# EAGLE schematic EYEO_Flower3 (EAGLE 9.6.2)
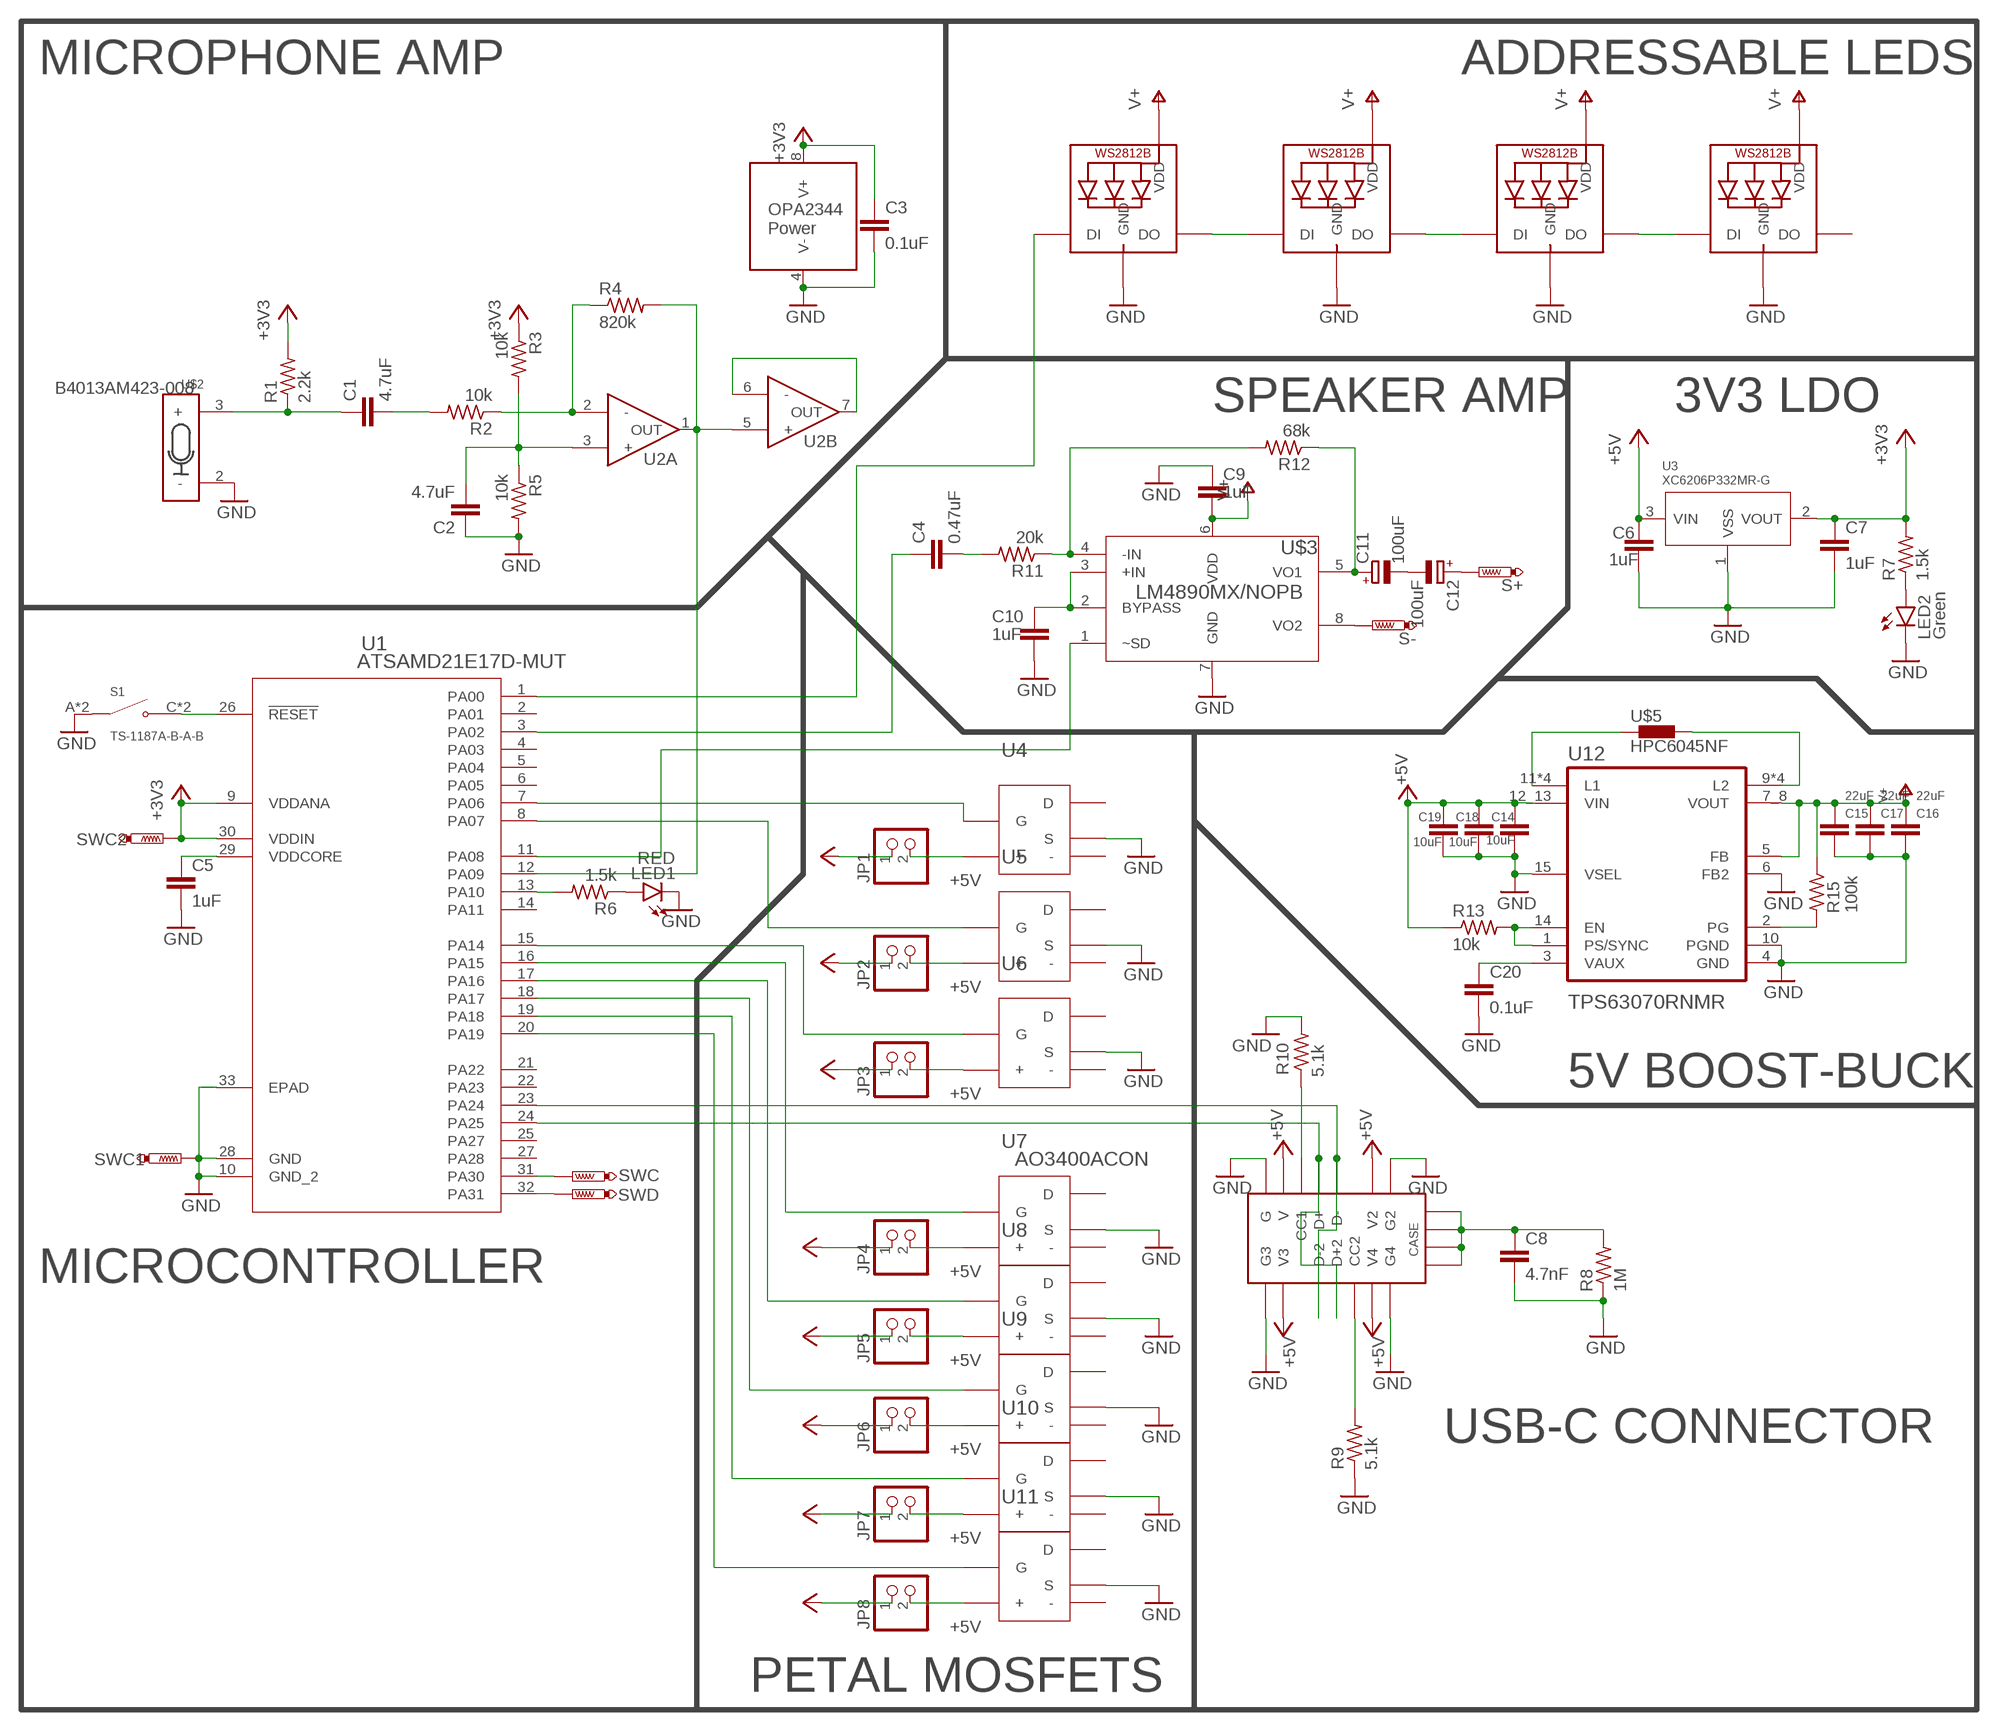
[diagram p0: schematic, sheet 1]

## Parts
C1  4.7uF  C-EUC0603  [C0603]
C2  4.7uF  C-EUC0603  [C0603]
C3  0.1uF  C-EUC0402  [C0402]
C4  0.47uF  C-EUC0603  [C0603]
C5  1uF  C-EUC0603  [C0603]
C6  1uF  C-EUC0603  [C0603]
C7  1uF  C-EUC0603  [C0603]
C8  4.7nF  C-EUC0402  [C0402]
C9  1uF  C-EUC0603  [C0603]
C10  1uF  C-EUC0603  [C0603]
C11  100uF  CPOL-EU153CLV-0505  [153CLV-0505]
C12  100uF  CPOL-EU153CLV-0505  [153CLV-0505]
C14  10uF  C-EUC0603  [C0603]
C15  22uF  C-EUC0603  [C0603]
C16  22uF  C-EUC0603  [C0603]
C17  22uF  C-EUC0603  [C0603]
C18  10uF  C-EUC0603  [C0603]
C19  10uF  C-EUC0603  [C0603]
C20  0.1uF  C-EUC0402  [C0402]
JP1  PINHD-1X2  [1X02]
JP2  PINHD-1X2  [1X02]
JP3  PINHD-1X2  [1X02]
JP4  PINHD-1X2  [1X02]
JP5  PINHD-1X2  [1X02]
JP6  PINHD-1X2  [1X02]
JP7  PINHD-1X2  [1X02]
JP8  PINHD-1X2  [1X02]
LED1  RED  LEDCHIPLED_0805  [CHIPLED_0805]
LED2  Green  LEDCHIPLED_0603  [CHIPLED_0603]
LED3  WS2812B5050  [WS2812B]
LED4  WS2812B5050  [WS2812B]
LED5  WS2812B5050  [WS2812B]
LED6  WS2812B5050  [WS2812B]
R1  2.2k  R-US_R0402  [R0402]
R2  10k  R-US_R0402  [R0402]
R3  10k  R-US_R0402  [R0402]
R4  820k  R-US_R0402  [R0402]
R5  10k  R-US_R0402  [R0402]
R6  1.5k  R-US_R0402  [R0402]
R7  1.5k  R-US_R0402  [R0402]
R8  1M  R-US_R0402  [R0402]
R9  5.1k  R-US_R0402  [R0402]
R10  5.1k  R-US_R0402  [R0402]
R11  20k  R-US_R0402  [R0402]
R12  68k  R-US_R0402  [R0402]
R13  10k  R-US_R0402  [R0402]
R15  100k  R-US_R0402  [R0402]
S1  TS-1187A-B-A-B  [SW_TS-1187A-B-A-B]
S+  PTR11MM  [1MM]
S-  PTR11MM  [1MM]
SWC  PTR1PAD1-13  [P1-13]
SWC1  PTR1PAD1-13  [P1-13]
SWC2  PTR1PAD1-13  [P1-13]
SWD  PTR1PAD1-13  [P1-13]
U1  ATSAMD21E17D-MUT  [QFN32_5X5MC_MCH]
U2  OPA2344UA  [D8]
U3  XC6206P332MR-G  PMIC-LDO-XC6206P332MR-G(SOT23)  [SOT-23]
U4  AO3400ACON  [SOT23-BCE-CON]
U5  AO3400ACON  [SOT23-BCE-CON]
U6  AO3400ACON  [SOT23-BCE-CON]
U7  AO3400ACON  [SOT23-BCE-CON]
U8  AO3400ACON  [SOT23-BCE-CON]
U9  AO3400ACON  [SOT23-BCE-CON]
U10  AO3400ACON  [SOT23-BCE-CON]
U11  AO3400ACON  [SOT23-BCE-CON]
U12  TPS63070RNMR  [VREG_TPS63070RNMR]
U$1  USB-C  [918-418K2022Y40000]
U$2  B4013AM423  [B4013AM423]
U$3  LM4890MX/NOPB  [M08A]
U$5  HPC6045NF  [HPC6045NF]

## Nets
+3V3: C3.1 C7.1 R1.2 R3.1 R7.2 SWC2.TP U1.9(VDDANA) U1.30(VDDIN) U2.8(C:V+) U3.2(VOUT)
+5V: C6.1 C14.1 C18.1 C19.1 JP1.1 JP2.1 JP3.1 JP4.1 JP5.1 JP6.1 JP7.1 JP8.1 R13.1 U3.3(VIN) U12.12_13(VIN) U$1.V U$1.V2 U$1.V3 U$1.V4
GND: C2.1 C3.2 C5.2 C6.2 C7.2 C8.2 C9.1 C10.2 C14.2 C15.2 C16.2 C17.2 C18.2 C19.2 C20.2 LED1.C LED2.C LED3.3-GND(GND) LED4.3-GND(GND) LED5.3-GND(GND) LED6.3-GND(GND) R5.2 R8.1 R9.1 R10.2 S1.A(COM) S1.B(COM) SWC1.TP U1.10(GND_2) U1.28(GND) U1.33(EPAD) U2.4(C:V-) U3.1(VSS) U4.S U5.S U6.S U7.S U8.S U9.S U10.S U11.S U12.4(GND) U12.6(FB2) U12.10(PGND) U12.15(VSEL) U$1.G U$1.G2 U$1.G3 U$1.G4 U$2.2(-) U$3.7(GND)
N$1: LED1.A R6.1
N$2: S1.C(NO) S1.D(NO) U1.26(!RESET)
N$3: LED2.A R7.1
N$4: C5.1 U1.29(VDDCORE)
N$5: C8.1 R8.2 U$1.OG1 U$1.OG2 U$1.OG3 U$1.OG4
N$6: R6.2 U1.13(PA10)
N$7: U1.23(PA24) U$1.D- U$1.D-2
N$8: U1.24(PA25) U$1.D+ U$1.D+2
N$11: R4.2 U1.12(PA09) U2.1(A:OUT) U2.5(B:+)
N$12: R2.1 R4.1 U2.2(A:-)
N$13: R10.1 U$1.CC1
N$14: R9.2 U$1.CC2
N$15: C2.2 R3.2 R5.1 U2.3(A:+)
N$16: C1.2 R2.2
N$17: C1.1 R1.1 U$2.3(+)
N$18: U2.6(B:-) U2.7(B:OUT)
N$19: C4.1 U1.3(PA02)
N$20: C4.2 R11.2
N$21: R11.1 R12.2 U$3.4(-IN)
N$22: C11.- C12.-
N$23: C10.1 U$3.2(BYPASS) U$3.3(+IN)
N$24: C11.+ R12.1 U$3.5(VO1)
N$25: U1.11(PA08) U$3.1(~SD)
N$26: S-.TP U$3.8(VO2)
N$27: U1.7(PA06) U4.G
N$28: U1.8(PA07) U5.G
N$29: U1.15(PA14) U6.G
N$30: U1.16(PA15) U7.G
N$31: U1.17(PA16) U8.G
N$32: U1.18(PA17) U9.G
N$33: U1.19(PA18) U10.G
N$34: U1.20(PA19) U11.G
N$35: LED3.4-DIN(DI) U1.1(PA00)
N$36: LED3.2-DOUT(DO) LED4.4-DIN(DI)
N$37: LED4.2-DOUT(DO) LED5.4-DIN(DI)
N$38: LED5.2-DOUT(DO) LED6.4-DIN(DI)
N$39: C12.+ S+.TP
N$40: JP1.2 U4.+
N$41: JP2.2 U5.+
N$42: JP3.2 U6.+
N$43: JP4.2 U7.+
N$44: JP5.2 U8.+
N$45: JP6.2 U9.+
N$46: JP7.2 U10.+
N$47: JP8.2 U11.+
N$49: R13.2 U12.1(PS/SYNC) U12.14(EN)
N$50: U12.11(L1) U12.11_1(L1) U12.11_2(L1) U12.11_3(L1) U$5.P$1
N$51: C20.1 U12.3(VAUX)
N$52: U12.9(L2) U12.9_1(L2) U12.9_2(L2) U12.9_3(L2) U$5.P$2
N$54: R15.2 U12.2(PG)
SWC: SWC.TP U1.31(PA30)
SWD: SWD.TP U1.32(PA31)
V+: C9.2 C15.1 C16.1 C17.1 LED3.1-VDD(VDD) LED4.1-VDD(VDD) LED5.1-VDD(VDD) LED6.1-VDD(VDD) R15.1 U12.5(FB) U12.7_8(VOUT) U$3.6(VDD)
Unconnected: LED6.2-DOUT(DO) U1.2(PA01) U1.4(PA03) U1.5(PA04) U1.6(PA05) U1.14(PA11) U1.21(PA22) U1.22(PA23) U1.25(PA27) U1.27(PA28) U4.- U4.D U5.- U5.D U6.- U6.D U7.- U7.D U8.- U8.D U9.- U9.D U10.- U10.D U11.- U11.D

## Notes on the sheet
- MICROPHONE AMP | ADDRESSABLE LEDS
- SPEAKER AMP | 3V3 LDO
- 5V BOOST-BUCK
- MICROCONTROLLER
- USB-C CONNECTOR
- PETAL MOSFETS

## Library data of the parts
C1 C2 = rcl_MOD:C-EU: CAPACITOR, European symbol; LCSC_PART: C19666; SPICEPREFIX: C
C3 C20 = rcl_MOD:C-EU: CAPACITOR, European symbol; LCSC_PART: C307331; SPICEPREFIX: C
C4 = rcl_MOD:C-EU: CAPACITOR, European symbol; LCSC_PART: C1623; SPICEPREFIX: C
C5-C7 C9 C10 = rcl_MOD:C-EU: CAPACITOR, European symbol; LCSC_PART: C15849; SPICEPREFIX: C
C8 = rcl_MOD:C-EU: CAPACITOR, European symbol; LCSC_PART: C1538; SPICEPREFIX: C
C11 C12 = rcl_MOD:CPOL-EU: POLARIZED CAPACITOR, European symbol; LCSC_PART: C3347; SPICEPREFIX: C
C14 C18 C19 = rcl_MOD:C-EU: CAPACITOR, European symbol; LCSC_PART: C96446; SPICEPREFIX: C
C15-C17 = rcl_MOD:C-EU: CAPACITOR, European symbol; LCSC_PART: C59461; SPICEPREFIX: C
JP1-JP8 = pinhead:PINHD-1X2: PIN HEADER; LCSC_PART: C2889984
LED1 = led:LED: LED OSRAM: - CHIPLED LG R971, LG N971, LY N971, LG Q971, LY Q971, LO R971, LY R971 LH N974, LH R974 LS Q976, LO Q976, LY Q976 LO Q996 - Hyper CHIPLED LW Q18S LB Q993, LB Q99A, LB R99A - SideLED LS A670, LO A670, LY A670, LG A670, LP A670 LB A673, LV A673, LT A673, LW A673 LH A674 LY A675 LS A676, LA A676, LO A676, LY A676, LW A676 LS A679, LY A679, LG A679 - Hyper Micro SIDELED® LS Y876, LA Y876, LO Y876, LY Y876 LT Y87S - SmartLED LW L88C, LW L88S LB L89C, LB L89S, LG L890 LS L89K, LO L89K, LY L89K LS L896, LA L896, LO L896, LY L896 - TOPLED LS T670, LO T670, LY T670, LG T670, LP T670 LSG T670, LSP T670, LSY T670, LOP T670, LYG T670 LG T671, LOG T671, LSG T671 LB T673, LV T673, LT T673, LW T673 LH T674 LS T676, LA T676, LO T676, LY T676, LB T676, LH T676, LSB T676, LW T676 LB T67C, LV T67C, LT T67C, LS T67K, LO T67K, LY T67K, LW E67C LS E67B, LA E67B, LO E67B, LY E67B, LB E67C, LV E67C, LT E67C LW T67C LS T679, LY T679, LG T679 LS T770, LO T770, LY T770, LG T770, LP T770 LB T773, LV T773, LT T773, LW T773 LH T774 LS E675, LA E675, LY E675, LS T675 LS T776, LA T776, LO T776, LY T776, LB T776 LHGB T686 LT T68C, LB T68C - Hyper Mini TOPLED® LB M676 - Mini TOPLED Santana® LG M470 LS M47K, LO M47K, LY M47K Source: http://www.osram.convergy.de LUXEON: - LUMILED® LXK2-PW12-R00, LXK2-PW12-S00, LXK2-PW14-U00, LXK2-PW14-V00 LXK2-PM12-R00, LXK2-PM12-S00, LXK2-PM14-U00 LXK2-PE12-Q00, LXK2-PE12-R00, LXK2-PE12-S00, LXK2-PE14-T00, LXK2-PE14-U00 LXK2-PB12-K00, LXK2-PB12-L00, LXK2-PB12-M00, LXK2-PB14-N00, LXK2-PB14-P00, LXK2-PB14-Q00 LXK2-PR12-L00, LXK2-PR12-M00, LXK2-PR14-Q00, LXK2-PR14-R00 LXK2-PD12-Q00, LXK2-PD12-R00, LXK2-PD12-S00 LXK2-PH12-R00, LXK2-PH12-S00 LXK2-PL12-P00, LXK2-PL12-Q00, LXK2-PL12-R00 Source: www.luxeon.com KINGBRIGHT: KA-3528ASYC Source: www.kingbright.com; LCSC_PART: C84256
LED2 = led:LED: LED OSRAM: - CHIPLED LG R971, LG N971, LY N971, LG Q971, LY Q971, LO R971, LY R971 LH N974, LH R974 LS Q976, LO Q976, LY Q976 LO Q996 - Hyper CHIPLED LW Q18S LB Q993, LB Q99A, LB R99A - SideLED LS A670, LO A670, LY A670, LG A670, LP A670 LB A673, LV A673, LT A673, LW A673 LH A674 LY A675 LS A676, LA A676, LO A676, LY A676, LW A676 LS A679, LY A679, LG A679 - Hyper Micro SIDELED® LS Y876, LA Y876, LO Y876, LY Y876 LT Y87S - SmartLED LW L88C, LW L88S LB L89C, LB L89S, LG L890 LS L89K, LO L89K, LY L89K LS L896, LA L896, LO L896, LY L896 - TOPLED LS T670, LO T670, LY T670, LG T670, LP T670 LSG T670, LSP T670, LSY T670, LOP T670, LYG T670 LG T671, LOG T671, LSG T671 LB T673, LV T673, LT T673, LW T673 LH T674 LS T676, LA T676, LO T676, LY T676, LB T676, LH T676, LSB T676, LW T676 LB T67C, LV T67C, LT T67C, LS T67K, LO T67K, LY T67K, LW E67C LS E67B, LA E67B, LO E67B, LY E67B, LB E67C, LV E67C, LT E67C LW T67C LS T679, LY T679, LG T679 LS T770, LO T770, LY T770, LG T770, LP T770 LB T773, LV T773, LT T773, LW T773 LH T774 LS E675, LA E675, LY E675, LS T675 LS T776, LA T776, LO T776, LY T776, LB T776 LHGB T686 LT T68C, LB T68C - Hyper Mini TOPLED® LB M676 - Mini TOPLED Santana® LG M470 LS M47K, LO M47K, LY M47K Source: http://www.osram.convergy.de LUXEON: - LUMILED® LXK2-PW12-R00, LXK2-PW12-S00, LXK2-PW14-U00, LXK2-PW14-V00 LXK2-PM12-R00, LXK2-PM12-S00, LXK2-PM14-U00 LXK2-PE12-Q00, LXK2-PE12-R00, LXK2-PE12-S00, LXK2-PE14-T00, LXK2-PE14-U00 LXK2-PB12-K00, LXK2-PB12-L00, LXK2-PB12-M00, LXK2-PB14-N00, LXK2-PB14-P00, LXK2-PB14-Q00 LXK2-PR12-L00, LXK2-PR12-M00, LXK2-PR14-Q00, LXK2-PR14-R00 LXK2-PD12-Q00, LXK2-PD12-R00, LXK2-PD12-S00 LXK2-PH12-R00, LXK2-PH12-S00 LXK2-PL12-P00, LXK2-PL12-Q00, LXK2-PL12-R00 Source: www.luxeon.com KINGBRIGHT: KA-3528ASYC Source: www.kingbright.com; LCSC_PART: C72043
LED3-LED6 = WS2812B:WS2812B: Check availability <https://pricing.snapeda.com/parts/WS2812B/Worldsemi/view-part?ref=eda>; AVAILABILITY: Not in stock; DESCRIPTION: Intelligent Control Led Integrated Light Source Pack Of 10; LCSC_PART: C2761795; MF: Worldsemi; MP: WS2812B; PACKAGE: None; PRICE: None
R1 = rcl_MOD:R-US_: RESISTOR, American symbol; LCSC_PART: C25879; SPICEPREFIX: R
R2 R3 R5 R13 = rcl_MOD:R-US_: RESISTOR, American symbol; LCSC_PART: C25744; SPICEPREFIX: R
R4 = rcl_MOD:R-US_: RESISTOR, American symbol; LCSC_PART: C67558; SPICEPREFIX: R
R6 R7 = rcl_MOD:R-US_: RESISTOR, American symbol; LCSC_PART: C25867; SPICEPREFIX: R
R8 = rcl_MOD:R-US_: RESISTOR, American symbol; LCSC_PART: C26083; SPICEPREFIX: R
R9 R10 = rcl_MOD:R-US_: RESISTOR, American symbol; LCSC_PART: C25905; SPICEPREFIX: R
R11 = rcl_MOD:R-US_: RESISTOR, American symbol; LCSC_PART: C25765; SPICEPREFIX: R
R12 = rcl_MOD:R-US_: RESISTOR, American symbol; LCSC_PART: C36871; SPICEPREFIX: R
R15 = rcl_MOD:R-US_: RESISTOR, American symbol; LCSC_PART: C25741; SPICEPREFIX: R
S1 = TS-1187A-B-A-B:TS-1187A-B-A-B: SPST 50mA @ 12VDC Top Actuated Round Button 160gf SMD Tactile Switches RoHS Check availability <https://pricing.snapeda.com/parts/TS-1187A-B-A-B/XKB%20Industrial%20Precision/view-part?ref=eda>; AVAILABILITY: Not in stock; DESCRIPTION: TS-1187A-B-A-B XKB Connectivity; LCSC_PART: C318884; MF: XKB Industrial Precision; MP: TS-1187A-B-A-B; PACKAGE: Package; PRICE: None
S+ S- = testpad:PTR1: TEST PIN; LCSC_PART: C238122
SWC SWC1 SWC2 SWD = testpad:PTR1: TEST PIN
U1 = ATSAMDE17D:ATSAMD21E17D-MUT; COPYRIGHT: Copyright (C) 2022 Ultra Librarian. All rights reserved.; DIGI-KEY_PART_NUMBER_1: ATSAMD21E17D-MUTCT-ND; DIGI-KEY_PART_NUMBER_2: ATSAMD21E17D-MUTDKR-ND; DIGI-KEY_PART_NUMBER_3: ATSAMD21E17D-MUTTR-ND; MANUFACTURER_PART_NUMBER: ATSAMD21E17D-MUT; MFR_NAME: Microchip
U2 = OPA2344:OPA2344UA; COPYRIGHT: Copyright (C) 2022 Ultra Librarian. All rights reserved.; DIGI-KEY_PART_NUMBER_1: OPA2344UA-ND; DIGI-KEY_PART_NUMBER_2: 2156-OPA2344UA-ND; DIGI-KEY_PART_NUMBER_3: 2156-OPA2344UA-TI-ND; LCSC_PART: C202213; MANUFACTURER_PART_NUMBER: OPA2344UA; MFR_NAME: Texas Instruments
U3 = PMIC-LDO-XC6206P332MR-G_SOT23_:PMIC-LDO-XC6206P332MR-G(SOT23): 310030099 Check availability <https://pricing.snapeda.com/parts/XC6206P332MR-G/Torex/view-part?ref=eda>; AVAILABILITY: In Stock; DESCRIPTION: Linear Voltage Regulator IC Positive Fixed 1 Output 200mA SOT-23; LCSC_PART: C5446; MF: Torex; MP: XC6206P332MR-G; PACKAGE: SOT-23-3 Torex; PRICE: None; PURCHASE-URL: https://pricing.snapeda.com/search/part/XC6206P332MR-G/?ref=eda
U4-U11 = AO3400A+con:AO3400A; LCSC_PART: C20917
U12 = TPS63070RNMR:TPS63070RNMR: Check availability <https://pricing.snapeda.com/parts/TPS63070RNMR/Texas%20Instruments/view-part?ref=eda>; AVAILABILITY: In Stock; DESCRIPTION: Wide input voltage (2V-16V) buck-boost converter; LCSC_PART: C2876599; MF: Texas Instruments; MP: TPS63070RNMR; PACKAGE: VQFN-HR-15 Texas Instruments; PRICE: None; PURCHASE-URL: https://pricing.snapeda.com/search/part/TPS63070RNMR/?ref=eda
U$1 = USB:USB-C; LCSC_PART: C168704
U$2 = Microphone:B4013AM423; LCSC_PART: C233794; NUM: B4013AM423-008
U$3 = LM4890:LM4890MX/NOPB; COPYRIGHT: Copyright (C) 2022 Ultra Librarian. All rights reserved.; DIGI-KEY_PART_NUMBER_1: 2156-LM4890MX/NOPB-ND; DIGI-KEY_PART_NUMBER_2: 296-47333-1-ND; DIGI-KEY_PART_NUMBER_3: 296-47333-2-ND; DIGI-KEY_PART_NUMBER_4: 296-47333-6-ND; DIGI-KEY_PART_NUMBER_5: LM4890MX/NOPBTR-ND; LCSC_PART: C117476; MANUFACTURER_PART_NUMBER: LM4890MX/NOPB; MFR_NAME: Texas Instruments
U$5 = inductors-mod:HPC6045NF; LCSC_PART: C357076